# Altium schematic sheet RS232.SchDoc
size A4; SheetNumber: 3; SheetTotal: 9
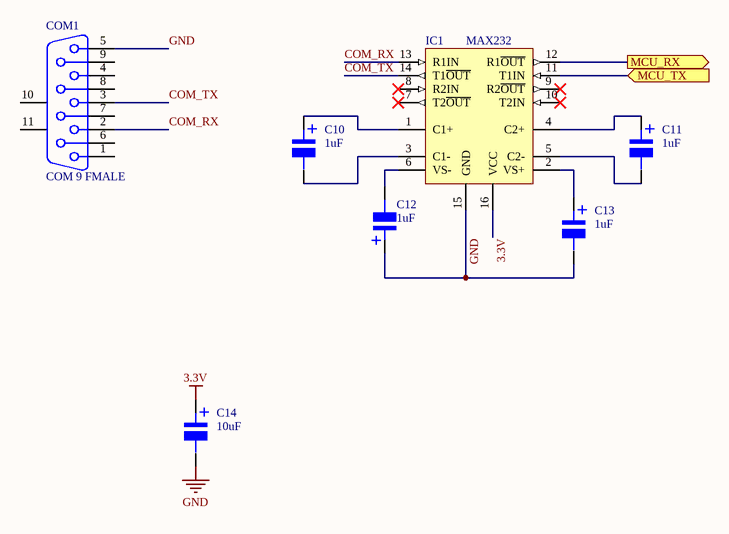
[diagram p0: RS232.SchDoc]

## Parts
C10  1uF  [tu nhom 4 (B)]
C11  1uF  [tu nhom 4 (B)]
C12  1uF  [tu nhom 4 (B)]
C13  1uF  [tu nhom 4 (B)]
C14  10uF  [tu nhom 4 (b)]
COM1  COM 9 FMALE  [DSB 9-F]
IC1  MAX232  [DIP16/W0.3]

## Ports
MCU_RX (out), MCU_TX (in)

## Nets
3.3V: C14.1 IC1.16(VCC)
GND: C12.1 C13.2 C14.2 COM1.5 IC1.15(GND)
COM_RX: COM1.2 IC1.13(R1IN)
COM_TX: COM1.3 IC1.14(T1~{OUT})
MCU_RX: IC1.12(R1~{OUT}) ; port MCU_RX
MCU_TX: IC1.11(T1IN) ; port MCU_TX
NetC10_1: C10.1 IC1.1(C1+)
NetC10_2: C10.2 IC1.3(C1-)
NetC11_1: C11.1 IC1.4(C2+)
NetC11_2: C11.2 IC1.5(C2-)
NetC12_2: C12.2 IC1.6(VS-)
NetC13_1: C13.1 IC1.2(VS+)

Not connected (* = marked no-connect by the designer): COM1 1 4 6 7 8 9 10(MH1) 11(MH2); IC1 7(T2~{OUT})* 8(R2IN)* 9(R2~{OUT})* 10(T2IN)*

## Notes on the sheet
- (in symbol Tu Nhom 1uF 50V) +
- (in symbol Tu Nhom 10uF 16V) +

## Library data of the parts
C10-C13 = Tu Nhom 1uF 50V: Dán; Don_Vi: Con; So_Chan: 2; Ten_Linh_Kien: Tụ Nhôm 1uF 50V 4x5.4MM; Ma_Hang: MH007467; Chung_Loai: Dán; Kieu_Chan: *
C14 = Tu Nhom 10uF 16V: Dán; Don_Vi: Con; So_Chan: 2; Ten_Linh_Kien: Tụ Nhôm 10uF 16V 4x5MM; Ma_Hang: MH001458; Chung_Loai: Dán; Kieu_Chan: *
COM1 = DSB9F: COM 9; PackageDocument: O; Positions: 9; Gender: Receptacle; Value: COM 9; Published: 15-Jun-2001; LatestRevisionDate: 17-Jul-2002; LatestRevisionNote: Re-released for DXP Platform.; DatasheetDocument: 1-Sep-1999; PackageReference: 788750; Publisher: Altium Limited; Orientation: Right Angle
IC1 = MAX232: Dual EIA-232 Driver/Receiver; Value: MAX232